# EAGLE schematic smart_container_v1.1 (EAGLE 9.5.0)
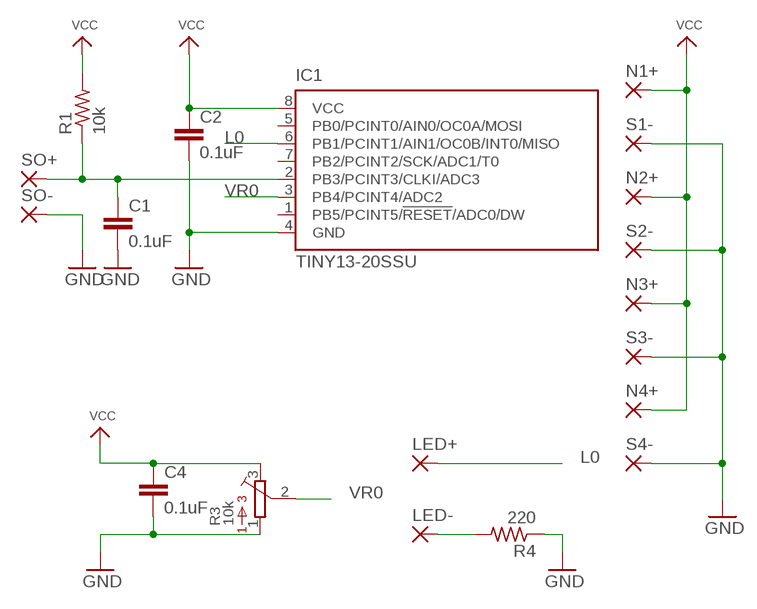
[diagram p0: schematic, sheet 1]

## Parts
C1  0.1uF  C-EUC0805  [C0805]
C2  0.1uF  C-EUC0805  [C0805]
C4  0.1uF  C-EUC0805  [C0805]
IC1  TINY13-20SSU  [8S1]
LED+  WIREPAD2,15/1,0  [2,15/1,0]
LED-  WIREPAD2,15/1,0  [2,15/1,0]
N1+  WIREPAD2,15/1,0  [2,15/1,0]
N2+  WIREPAD2,15/1,0  [2,15/1,0]
N3+  WIREPAD2,15/1,0  [2,15/1,0]
N4+  WIREPAD2,15/1,0  [2,15/1,0]
R1  10k  R-US_M0805  [M0805]
R3  10k  3386-P  [3386P]
R4  220  R-US_M0805  [M0805]
S1-  WIREPAD2,15/1,0  [2,15/1,0]
S2-  WIREPAD2,15/1,0  [2,15/1,0]
S3-  WIREPAD2,15/1,0  [2,15/1,0]
S4-  WIREPAD2,15/1,0  [2,15/1,0]
SO+  WIREPAD2,15/1,0  [2,15/1,0]
SO-  WIREPAD2,15/1,0  [2,15/1,0]

## Nets
GND: C1.2 C2.2 IC1.4(GND) R4.1 S1-.1(P) S2-.1(P) S3-.1(P) S4-.1(P) SO-.1(P)
L0: IC1.6(PB1/PCINT1/AIN1/OC0B/INT0/MISO) LED+.1(P)
N4+: C4.1 R3.3 ; supply symbol labelled VCC
N$2: LED-.1(P) R4.2
N$7: C1.1 IC1.2(PB3/PCINT3/CLKI/ADC3) R1.1 SO+.1(P)
S4-: C4.2 R3.1 ; supply symbol labelled GND
VCC: C2.1 IC1.8(VCC) N1+.1(P) N2+.1(P) N3+.1(P) N4+.1(P) R1.2
VR0: IC1.3(PB4/PCINT4/ADC2) R3.2
Unconnected: IC1.1(PB5/PCINT5/!RESET!/ADC0/DW) IC1.5(PB0/PCINT0/AIN0/OC0A/MOSI) IC1.7(PB2/PCINT2/SCK/ADC1/T0)

## Library data of the parts
C1 C2 C4 = resistor:C-EU: CAPACITOR, European symbol
IC1 = atmel:TINY13: 8-bit AVR Microcontroller with 1K Bytes In-System Programmable Flash Source: http://www.atmel.com/dyn/resources/prod_documents/2535S.pdf; MPN: ATTINY13-20SSU; OC_FARNELL: 1455133; OC_NEWARK: 58M3771
LED+ LED- N1+ N2+ N3+ N4+ S1- S2- S3- S4- SO+ SO- = wirepad:WIREPAD: Wire PAD connect wire on PCB
R1 R4 = adafruit:R-US_: RESISTOR, American symbol
R3 = bournsP:3386-: 3386 Series 3/8" Square Trimmer